# Altium schematic sheet EPS_CTRL_B.SchDoc: CTRL-B
size A3; SheetNumber: 24; SheetTotal: 51
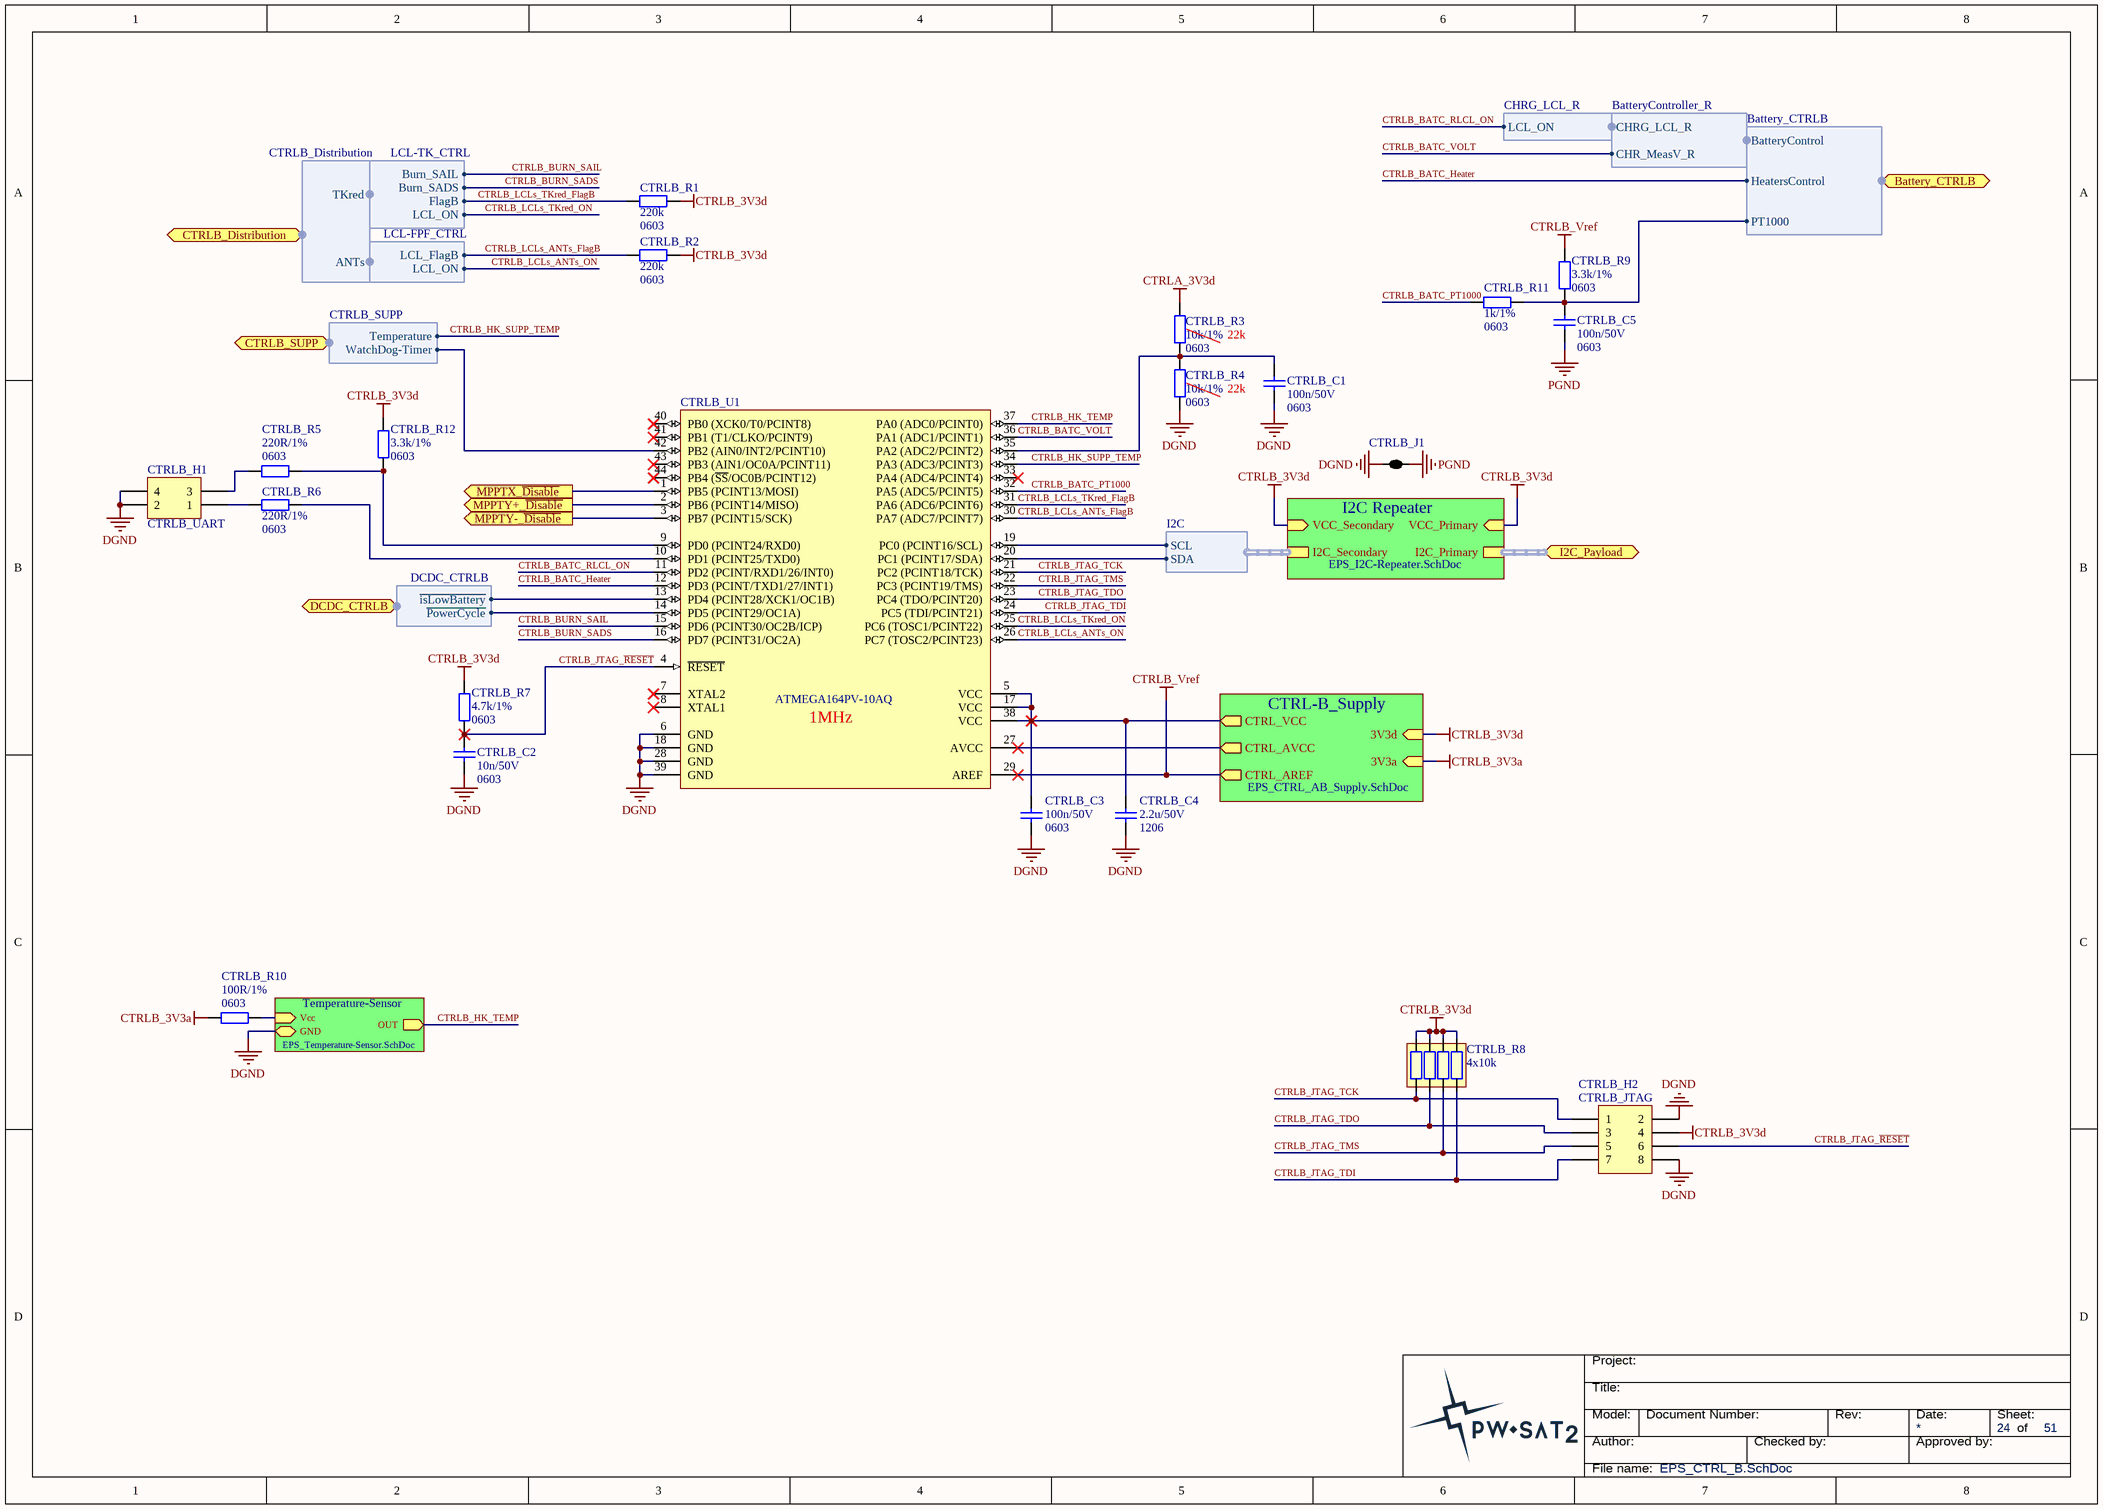
[diagram p0: EPS_CTRL_B.SchDoc]

## Parts
CTRLB_C1  Package: 0603  [SMD_Capacitor_0603]  (hidden comment: 100n/50V)
CTRLB_C2  Package: 0603  [SMD_Capacitor_0603]  (hidden comment: 10n/50V)
CTRLB_C3  Package: 0603  [SMD_Capacitor_0603]  (hidden comment: 100n/50V)
CTRLB_C4  Package: 1206  [SMD_Capacitor_1206]  (hidden comment: 2.2u/50V)
CTRLB_C5  Package: 0603  [SMD_Capacitor_0603]  (hidden comment: 100n/50V)
CTRLB_H1  CTRLB_UART  [Connfly_DS1031-04-2]
CTRLB_H2  CTRLB_JTAG  [Connfly_DS1031-08-2]
CTRLB_J1  2 way net tie junction  [2way_LP]  (value not drawn)  (net tie, no BOM)
CTRLB_R1  Package: 0603  [SMD_Resistor_0603]  (hidden comment: 220k)
CTRLB_R2  Package: 0603  [SMD_Resistor_0603]  (hidden comment: 220k)
CTRLB_R3  Package: 0603  [SMD_Resistor_0603]  (hidden comment: 10k/1%)
CTRLB_R4  Package: 0603  [SMD_Resistor_0603]  (hidden comment: 10k/1%)
CTRLB_R5  Package: 0603  [SMD_Resistor_0603]  (hidden comment: 220R/1%)
CTRLB_R6  Package: 0603  [SMD_Resistor_0603]  (hidden comment: 220R/1%)
CTRLB_R7  Package: 0603  [SMD_Resistor_0603]  (hidden comment: 4.7k/1%)
CTRLB_R8  4x10k  [SMD_RESISTOR_ARRAY_YC124]
CTRLB_R9  Package: 0603  [SMD_Resistor_0603]  (hidden comment: 3.3k/1%)
CTRLB_R10  Package: 0603  [SMD_Resistor_0603]  (hidden comment: 100R/1%)
CTRLB_R11  Package: 0603  [SMD_Resistor_0603]  (hidden comment: 1k/1%)
CTRLB_R12  Package: 0603  [SMD_Resistor_0603]  (hidden comment: 3.3k/1%)
CTRLB_U1  ATMEGA164PV-10AQ  [TQFP-44]

## Sub-sheets
CTRL-B_Supply = EPS_CTRL_AB_Supply.SchDoc: CTRL_VCC (out), CTRL_AVCC (out), CTRL_AREF (out), 3V3d (in), 3V3a (in)
I2C Repeater = EPS_I2C-Repeater.SchDoc: I2C_Primary (harness I2C), I2C_Secondary (harness I2C), VCC_Secondary (in), VCC_Primary (in)
Temperature-Sensor = EPS_Temperature-Sensor.SchDoc: OUT (out), Vcc (in), GND

## Ports
Battery_CTRLB (harness Battery_CTRLB), CTRLB_Distribution (harness CTRLB_Distribution), CTRLB_SUPP (harness CTRLB_SUPP), DCDC_CTRLB (harness DCDC_CTRLB), I2C_Payload (harness I2C), MPPTX_~{Disable} (out), MPPTY+_~{Disable} (out), MPPTY-_~{Disable} (out)

## Harnesses
I2C: SDA, SCL
DCDC_CTRLB: ~{PowerCycle}, ~{isLowBattery}
Battery_CTRLB: BatteryControl, HeatersControl, PT1000
BatteryController_R: CHRG_LCL_R, CHR_MeasV_R
CHRG_LCL_R: LCL_ON
CTRLB_Distribution: TKred, ANTs
LCL-TK_CTRL: FlagB, LCL_ON, Burn_SAIL, Burn_SADS
LCL-FPF_CTRL: LCL_FlagB, LCL_ON
CTRLB_SUPP: Temperature, WatchDog-Timer

## Nets
CTRLA_3V3d: CTRLB_R3.2
CTRLB_3V3a: CTRLB_R10.2 ; sheet CTRL-B_Supply/3V3a
CTRLB_3V3d: CTRLB_H2.4 CTRLB_R1.1 CTRLB_R2.1 CTRLB_R7.2 CTRLB_R8.1 CTRLB_R8.2 CTRLB_R8.3 CTRLB_R8.4 CTRLB_R12.2 ; sheet I2C Repeater/VCC_Secondary, sheet I2C Repeater/VCC_Primary, sheet CTRL-B_Supply/3V3d
CTRLB_Vref: CTRLB_R9.2 CTRLB_U1.29(AREF) ; sheet CTRL-B_Supply/CTRL_AREF
DGND: CTRLB_C1.2 CTRLB_C2.2 CTRLB_C3.2 CTRLB_C4.2 CTRLB_H1.2 CTRLB_H1.4 CTRLB_H2.2 CTRLB_H2.8 CTRLB_J1.2 CTRLB_R4.1 CTRLB_U1.6(GND) CTRLB_U1.18(GND) CTRLB_U1.28(GND) CTRLB_U1.39(GND) ; sheet Temperature-Sensor/GND
PGND: CTRLB_C5.2 CTRLB_J1.1
CTRLB_BATC_Heater: CTRLB_U1.12(PD3_(PCINT/TXD1/27/INT1)) ; port Battery_CTRLB.HeatersControl
CTRLB_BATC_PT1000: CTRLB_R11.2 CTRLB_U1.32(PA5_(ADC5/PCINT5))
CTRLB_BATC_RLCL_ON: CTRLB_U1.11(PD2_(PCINT/RXD1/26/INT0)) ; harness CHRG_LCL_R.LCL_ON
CTRLB_BATC_VOLT: CTRLB_U1.36(PA1_(ADC1/PCINT1)) ; harness BatteryController_R.CHR_MeasV_R
CTRLB_BURN_SADS: CTRLB_U1.16(PD7_(PCINT31/OC2A)) ; harness LCL-TK_CTRL.Burn_SADS
CTRLB_BURN_SAIL: CTRLB_U1.15(PD6_(PCINT30/OC2B/ICP)) ; harness LCL-TK_CTRL.Burn_SAIL
CTRLB_HK_SUPP_TEMP: CTRLB_U1.34(PA3_(ADC3/PCINT3)) ; port CTRLB_SUPP.Temperature
CTRLB_HK_TEMP: CTRLB_U1.37(PA0_(ADC0/PCINT0)) ; sheet Temperature-Sensor/OUT
CTRLB_JTAG_~{RESET}: CTRLB_C2.1 CTRLB_H2.6 CTRLB_R7.1 CTRLB_U1.4(~{RESET})
CTRLB_JTAG_TCK: CTRLB_H2.1 CTRLB_R8.8 CTRLB_U1.21(PC2_(PCINT18/TCK))
CTRLB_JTAG_TDI: CTRLB_H2.7 CTRLB_R8.5 CTRLB_U1.24(PC5_(TDI/PCINT21))
CTRLB_JTAG_TDO: CTRLB_H2.3 CTRLB_R8.7 CTRLB_U1.23(PC4_(TDO/PCINT20))
CTRLB_JTAG_TMS: CTRLB_H2.5 CTRLB_R8.6 CTRLB_U1.22(PC3_(PCINT19/TMS))
CTRLB_LCLs_ANTs_FlagB: CTRLB_R2.2 CTRLB_U1.30(PA7_(ADC7/PCINT7)) ; harness LCL-FPF_CTRL.LCL_FlagB
CTRLB_LCLs_ANTs_ON: CTRLB_U1.26(PC7_(TOSC2/PCINT23)) ; harness LCL-FPF_CTRL.LCL_ON
CTRLB_LCLs_TKred_FlagB: CTRLB_R1.2 CTRLB_U1.31(PA6_(ADC6/PCINT6)) ; harness LCL-TK_CTRL.FlagB
CTRLB_LCLs_TKred_ON: CTRLB_U1.25(PC6_(TOSC1/PCINT22)) ; harness LCL-TK_CTRL.LCL_ON
MPPTX_~{Disable}: CTRLB_U1.1(PB5_(PCINT13/MOSI)) ; port MPPTX_~{Disable}
MPPTY+_~{Disable}: CTRLB_U1.2(PB6_(PCINT14/MISO)) ; port MPPTY+_~{Disable}
MPPTY-_~{Disable}: CTRLB_U1.3(PB7_(PCINT15/SCK)) ; port MPPTY-_~{Disable}
NetCTRLB_C1_1: CTRLB_C1.1 CTRLB_R3.1 CTRLB_R4.2 CTRLB_U1.35(PA2_(ADC2/PCINT2))
NetCTRLB_C3_1: CTRLB_C3.1 CTRLB_C4.1 CTRLB_U1.5(VCC) CTRLB_U1.17(VCC) CTRLB_U1.38(VCC) ; sheet CTRL-B_Supply/CTRL_VCC
NetCTRLB_C5_1: CTRLB_C5.1 CTRLB_R9.1 CTRLB_R11.1 ; port Battery_CTRLB.PT1000
NetCTRLB_H1_1: CTRLB_H1.1 CTRLB_R6.1
NetCTRLB_H1_3: CTRLB_H1.3 CTRLB_R5.1
NetCTRLB_R5_2: CTRLB_R5.2 CTRLB_R12.1 CTRLB_U1.9(PD0_(PCINT24/RXD0))
NetCTRLB_R6_2: CTRLB_R6.2 CTRLB_U1.10(PD1_(PCINT25/TXD0))
NetCTRLB_R10_1: CTRLB_R10.1 ; sheet Temperature-Sensor/Vcc
NetCTRLB_U1_13: CTRLB_U1.13(PD4_(PCINT28/XCK1/OC1B)) ; port DCDC_CTRLB.~{isLowBattery}
NetCTRLB_U1_14: CTRLB_U1.14(PD5_(PCINT29/OC1A)) ; port DCDC_CTRLB.~{PowerCycle}
NetCTRLB_U1_19: CTRLB_U1.19(PC0_(PCINT16/SCL)) ; sheet I2C Repeater/I2C_Secondary.SCL
NetCTRLB_U1_20: CTRLB_U1.20(PC1_(PCINT17/SDA)) ; sheet I2C Repeater/I2C_Secondary.SDA
NetCTRLB_U1_27: CTRLB_U1.27(AVCC) ; sheet CTRL-B_Supply/CTRL_AVCC
NetCTRLB_U1_42: CTRLB_U1.42(PB2_(AIN0/INT2/PCINT10)) ; port CTRLB_SUPP.WatchDog-Timer

Not connected (* = marked no-connect by the designer): CTRLB_U1 7(XTAL2)* 8(XTAL1)* 33(PA4_(ADC4/PCINT4))* 40(PB0_(XCK0/T0/PCINT8))* 41(PB1_(T1/CLKO/PCINT9))* 43(PB3_(AIN1/OC0A/PCINT11))* 44(PB4_(~{SS}/OC0B/PCINT12))*

## Buses and harness runs
harness port I2C_Payload = sheet I2C Repeater/I2C_Primary

## Notes on the sheet
- 22k
- (near CTRLB_U1) 1MHz
- Title:
- Project:
- Author:
- Model:
- Document Number:
- Checked by:
- Rev:
- Date:
- Approved by:
- Sheet:
- of
- File name:

## Library data of the parts
CTRLB_C1-CTRLB_C3 CTRLB_C5 = Cer_C0603T104K5RALTU: Ceramic Cap Kemet COTS 100n/50V X7R 0603; Manufacturer: Kemet; ManufacturerPartNumber: C0603T104K5RALTU
  CTRLB_C1 CTRLB_C3 CTRLB_C5: Value: 100n/50V
  CTRLB_C2: Value: 10n/50V
CTRLB_C4 = Cer_GCJ31CR71H225KA12L: Ceramic Cap Murata Automotive 2.2u/50V X7R 1206; Manufacturer: Murata; ManufacturerPartNumber: GCJ31CR71H225KA12L; Value: 2.2u/50V
CTRLB_H1 = Header 2X2: Header, 2-Pin, Dual row; LatestRevisionDate: 17-Jul-2002; LatestRevisionNote: Re-released for DXP Platform.; Publisher: Altium Limited
CTRLB_H2 = Header 4X2: Header, 4-Pin, Dual row; LatestRevisionDate: 17-Jul-2002; LatestRevisionNote: Re-released for DXP Platform.; Publisher: Altium Limited
CTRLB_J1 = 2way: ComponentLink1URL: http://www.edatools.cz/addons; ComponentLink1Description: Source; FootprintNote: LP=12mil, MP=40mil, HP=120mil
CTRLB_R1-CTRLB_R7 CTRLB_R9 CTRLB_R11 CTRLB_R12 = CRCW06034K70FKxxxx: 4.7k/1% Vishay CRCW 0603 Resistor. 100mW, 100ppm, 75V.; Manufacturer: Vishay; ManufactuerPartNumber: CRCW06034K70FKxxxx
  CTRLB_R1 CTRLB_R2: Value: 220k
  CTRLB_R3 CTRLB_R4: Value: 10k/1%
  CTRLB_R5 CTRLB_R6: Value: 220R/1%
  CTRLB_R7: Value: 4.7k/1%
  CTRLB_R9 CTRLB_R12: Value: 3.3k/1%
  CTRLB_R11: Value: 1k/1%
CTRLB_R8 = YC124-JR-072K2L: RESISTOR ARRAY, 4 x 0402; URL: http://pl.farnell.com/yageo-phycomp/yc124-jr-072k2l/resistor-array-arv341-4-x-0402/dp/9235388
CTRLB_R10 = CRCW06031K00FKxxxx: 1k/1% Vishay CRCW 0603 Resistor. 100mW, 100ppm, 75V.; Manufacturer: Vishay; ManufacturerPartNumber: CRCW06031K00FKxxxx; Value: 100R/1%
CTRLB_U1 = ATMEGA164PV-10AQ: General-purpose microcontroller; Value: ATMEGA164PV-10AQ